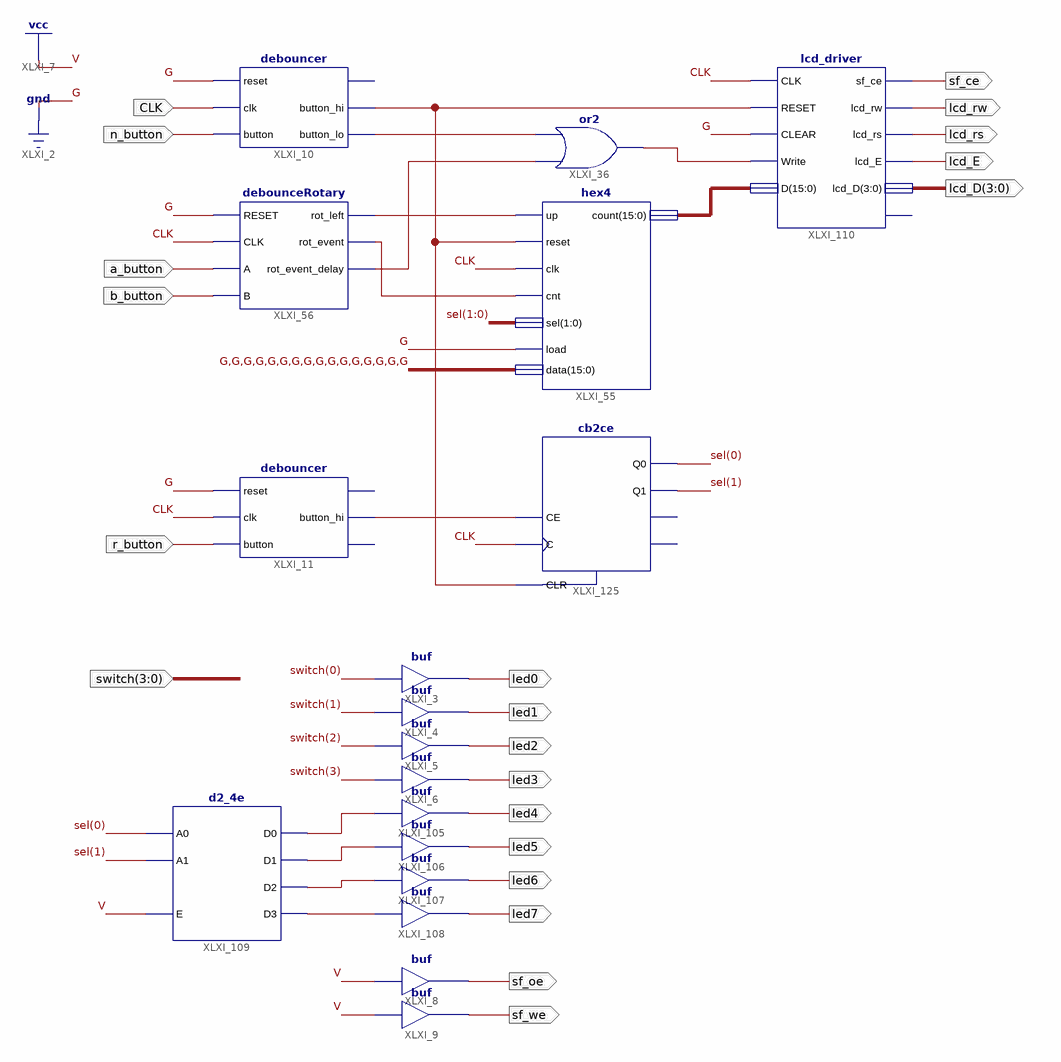
[diagram p0: schematic sheet 1]
// Xilinx ISE schematic io_block.sch (spartan3e) as structural Verilog: 18 symbols, 22 ports
module io_block (
  input  n_button,
  input  a_button,
  input  CLK,
  input  b_button,
  input  r_button,
  input  [3:0] switch,
  output V,
  output sf_ce,
  output lcd_rw,
  output lcd_E,
  output lcd_rs,
  output [3:0] lcd_D,
  output led0,
  output led1,
  output led2,
  output led3,
  output led4,
  output led5,
  output led6,
  output led7,
  output sf_oe,
  output sf_we
);

  wire button_hi, RESET, rot_event, rot_left, XLXN_59, XLXN_61, XLXN_63, XLXN_64, XLXN_65, XLXN_66, XLXN_67;
  wire [1:0] sel;
  wire [15:0] count;

  debouncer XLXI_10 (
    .button(n_button), .button_hi(RESET), .button_lo(XLXN_63), .clk(CLK), .reset(1'b0));  // open: debutton
  debounceRotary XLXI_56 (
    .CLK(CLK), .RESET(1'b0), .A(a_button), .B(b_button), .rot_event(rot_event), .rot_left(rot_left),
    .rot_event_delay(XLXN_59));
  or XLXI_36 (XLXN_61, XLXN_59, XLXN_63);
  hex4 XLXI_55 (
    .up(rot_left), .reset(RESET), .clk(CLK), .load(1'b0), .data({16{1'b0}}), .cnt(rot_event), .sel(sel),
    .count(count));
  lcd_driver XLXI_110 (
    .CLK(CLK), .RESET(RESET), .CLEAR(1'b0), .Write(XLXN_61), .D(count), .lcd_E(lcd_E), .lcd_rs(lcd_rs),
    .lcd_D(lcd_D), .sf_ce(sf_ce), .lcd_rw(lcd_rw));  // open: lcdReady
  debouncer XLXI_11 (.button(r_button), .button_hi(button_hi), .clk(CLK), .reset(1'b0));  // open: button_lo, debutton
  cb2ce XLXI_125 (.C(CLK), .CE(button_hi), .CLR(RESET), .Q0(sel[0]), .Q1(sel[1]));  // open: CEO, TC
  buf XLXI_3 (led0, switch[0]);
  buf XLXI_4 (led1, switch[1]);
  buf XLXI_5 (led2, switch[2]);
  buf XLXI_6 (led3, switch[3]);
  buf XLXI_105 (led4, XLXN_67);
  buf XLXI_106 (led5, XLXN_66);
  buf XLXI_107 (led6, XLXN_65);
  buf XLXI_108 (led7, XLXN_64);
  buf XLXI_8 (sf_oe, 1'b1);
  buf XLXI_9 (sf_we, 1'b1);
  d2_4e XLXI_109 (.A0(sel[0]), .A1(sel[1]), .E(1'b1), .D0(XLXN_67), .D1(XLXN_66), .D2(XLXN_65), .D3(XLXN_64));

  assign V = 1'b1;
endmodule
